# Altium schematic sheet H-Bridge.SchDoc
size A4; SheetNumber: 1; SheetTotal: 3
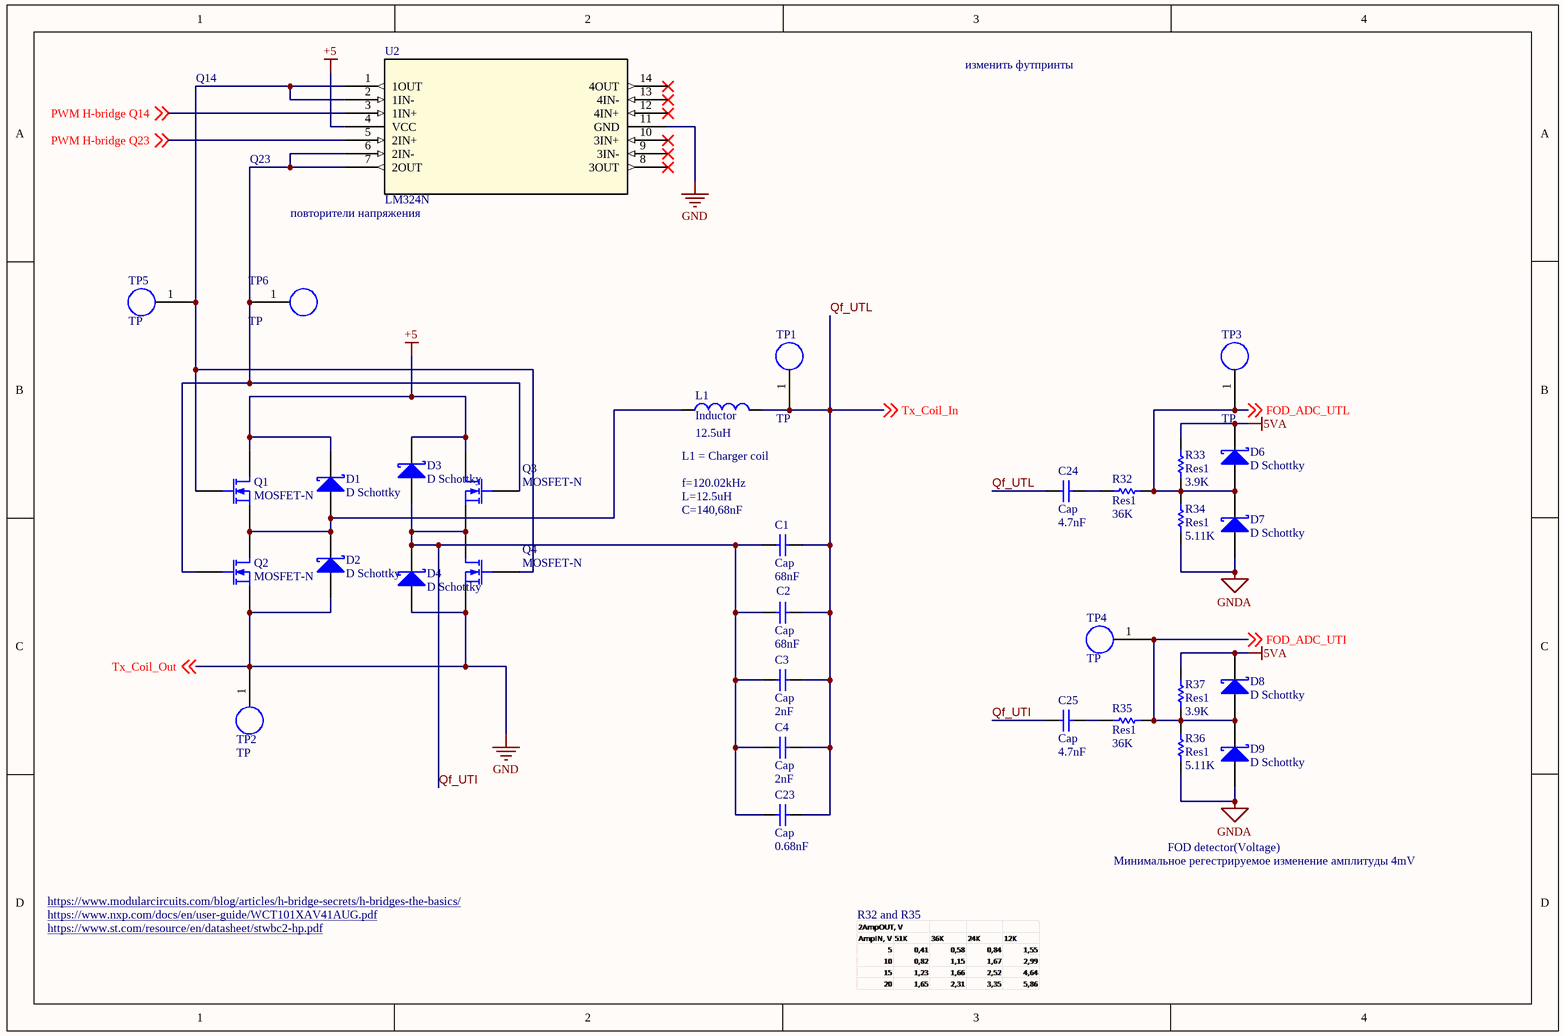
[diagram p0: H-Bridge.SchDoc]

## Parts
C1  Cap  value 68nF  [CAP 0603_1608]
C2  Cap  value 68nF  [CAP 0603_1608]
C3  Cap  value 2nF  [CAP 0603_1608]
C4  Cap  value 2nF  [CAP 0603_1608]
C23  Cap  value 0.68nF  [CAP 0603_1608]
C24  Cap  value 4.7nF  [CAP 0402_1005]
C25  Cap  value 4.7nF  [CAP 0402_1005]
D1  D Schottky  [SOD-123]
D2  D Schottky  [SOD-123]
D3  D Schottky  [SOD-123]
D4  D Schottky  [SOD-123]
D6  D Schottky  [SOD-123]
D7  D Schottky  [SOD-123]
D8  D Schottky  [SOD-123]
D9  D Schottky  [SOD-123]
L1  Inductor  value 12.5uH  [Charger_Coil1]
Q1  MOSFET-N  [DIODES SOT-23-3]
Q2  MOSFET-N  [DIODES SOT-23-3]
Q3  MOSFET-N  [DIODES SOT-23-3]
Q4  MOSFET-N  [DIODES SOT-23-3]
R32  Res1  value 36K  [RES 0402_1005]
R33  Res1  value 3.9K  [RES 0402_1005]
R34  Res1  value 5.11K  [RES 0603_1608]
R35  Res1  value 36K  [RES 0402_1005]
R36  Res1  value 5.11K  [RES 0603_1608]
R37  Res1  value 3.9K  [RES 0402_1005]
TP1  TP  [Testpoint1]  (no BOM)
TP2  TP  [Testpoint1]  (no BOM)
TP3  TP  [Testpoint1]  (no BOM)
TP4  TP  [Testpoint1]  (no BOM)
TP5  TP  [Testpoint1]  (no BOM)
TP6  TP  [Testpoint1]  (no BOM)
U2  LM324N  [LM324NSR]

## Nets
5VA: D6.2(K) D8.2(K) R33.1 R37.2
+5: D1.2(K) D3.2(K) Q1.1(D) Q3.1(D) U2.4(VCC)
GND: D2.1(A) D4.1(A) Q2.3(S) Q4.3(S) TP2.1 U2.11(GND) ; off-sheet Tx_Coil_Out  [also labelled Tx_Coil_Out]
GNDA: D7.1(A) D9.1(A) R34.1 R36.1
FOD_ADC_UTI: D8.1(A) D9.2(K) R35.2 R36.2 R37.1 TP4.1 ; off-sheet FOD_ADC_UTI
FOD_ADC_UTL: D6.1(A) D7.2(K) R32.1 R33.2 R34.2 TP3.1 ; off-sheet FOD_ADC_UTL
PWM H-bridge Q14: U2.3(1IN+) ; off-sheet PWM H-bridge Q14
PWM H-bridge Q23: U2.5(2IN+) ; off-sheet PWM H-bridge Q23
Qf_UTI: C1.1 C2.1 C3.1 C4.1 C23.2 C25.1 D3.1(A) D4.2(K) Q3.3(S) Q4.1(D)
Qf_UTL: C1.2 C2.2 C3.2 C4.2 C23.1 C24.1 L1.2 TP1.1 ; off-sheet Tx_Coil_In  [also labelled Tx_Coil_In]
NetC24_2: C24.2 R32.2
NetC25_2: C25.2 R35.1
NetD1_1: D1.1(A) D2.2(K) L1.1 Q1.3(S) Q2.1(D)
NetQ1_2: Q1.2(G) Q4.2(G) TP5.1 U2.1(1OUT) U2.2(1IN-)
NetQ2_2: Q2.2(G) Q3.2(G) TP6.1 U2.6(2IN-) U2.7(2OUT)

Not connected (* = marked no-connect by the designer): U2 8(3OUT)* 9(3IN-)* 10(3IN+)* 12(4IN+)* 13(4IN-)* 14(4OUT)*

## Notes on the sheet
- Q14
- изменить футпринты
- Q23
- (near U2) повторители напряжения
- (near L1) L1 = Charger coil
- (near C1) C=140,68nF
- f=120.02kHz
- L=12.5uH
- FOD detector(Voltage)
- https://www.modularcircuits.com/blog/articles/h-bridge-secrets/h-bridges-the-basics/
- https://www.nxp.com/docs/en/user-guide/WCT101XAV41AUG.pdf
- R32 and R35
- Минимальное регестрируемое изменение амплитуды 4mV
- https://www.st.com/resource/en/datasheet/stwbc2-hp.pdf

## Library data of the parts
C1-C4 C23-C25 = Cap: Capacitor; Published: 8-Jun-2000; LatestRevisionDate: 17-Jul-2002; LatestRevisionNote: Re-released for DXP Platform.; PackageReference: RAD-0.3; Publisher: Altium Limited; PackageDescription: Radial Cap, Thru-Hole; 2 Leads; 0.3 in Pin Spacing
D1-D4 D6-D9 = D Schottky: Schottky Diode; Published: 8-Jun-2000; LatestRevisionDate: 17-Jul-2002; LatestRevisionNote: Re-released for DXP Platform.; PackageReference: SMB; Publisher: Altium Limited; PackageDescription: DO-214-AA/SMB; 2 C-Bend Leads; Body 5.3 x 3.6 mm, inc. leads (LxW); Code_JEDEC: DO-214-AA
L1 = Inductor: Code_IEC: 1005; Published: 8-Jun-2000; LatestRevisionDate: 29-May-2009; LatestRevisionNote: IPC-7351 Footprint Added.; PackageReference: 0402-A; Publisher: Altium Limited; PackageDescription: Chip Inductor; Code_JEITA: 0402
Q1-Q4 = MOSFET-N: N-Channel MOSFET; Published: 8-Jun-2000; LatestRevisionDate: 17-Jul-2002; LatestRevisionNote: Re-released for DXP Platform.; PackageVersion: 1995/1996; PackageReference: E3; Publisher: Altium Limited; PackageDescription: TO, Flat Index; 3 In-Line, Axial Leads; Body Dia. 4.6mm; Lead Dia. 0.5 mm (max)
R32-R37 = Res1: Resistor; Published: 8-Jun-2000; LatestRevisionDate: 17-Jul-2002; LatestRevisionNote: Re-released for DXP Platform.; PackageReference: AXIAL-0.3; Publisher: Altium Limited; PackageDescription: Axial Device, Thru-Hole; 2 Leads; 0.3 in Pin Spacing
TP1-TP6 = Testpoint1
U2 = LM324N: No Description Available; Mfr_Name: Texas Instruments; RefDes: RefDes; Type: Type